# EAGLE schematic dangerous-DSO-v1a (EAGLE 5.07)
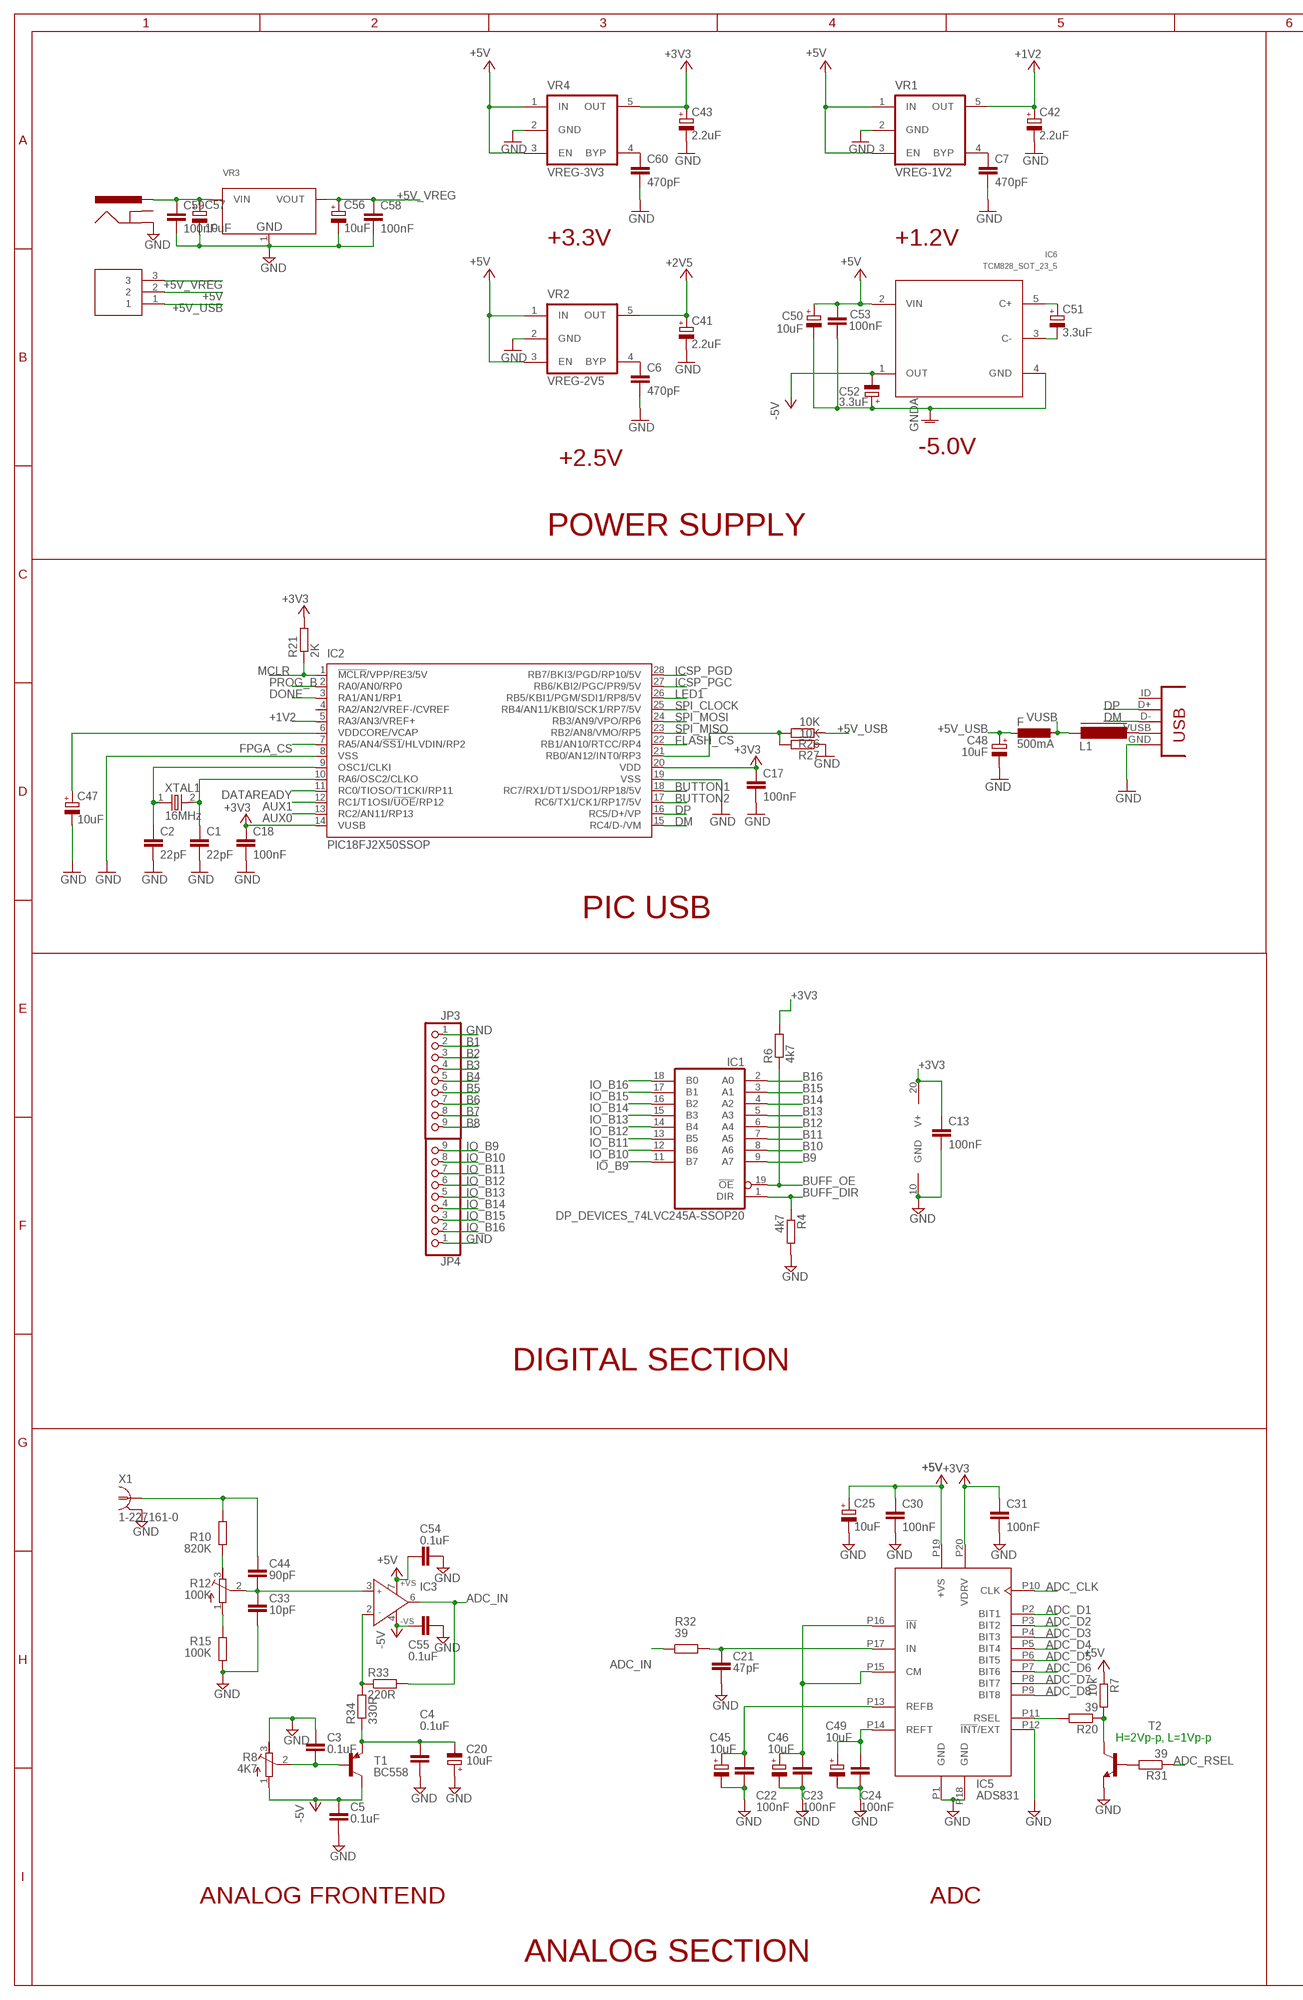
[diagram p0: schematic, sheet 1, part 1 of 2]
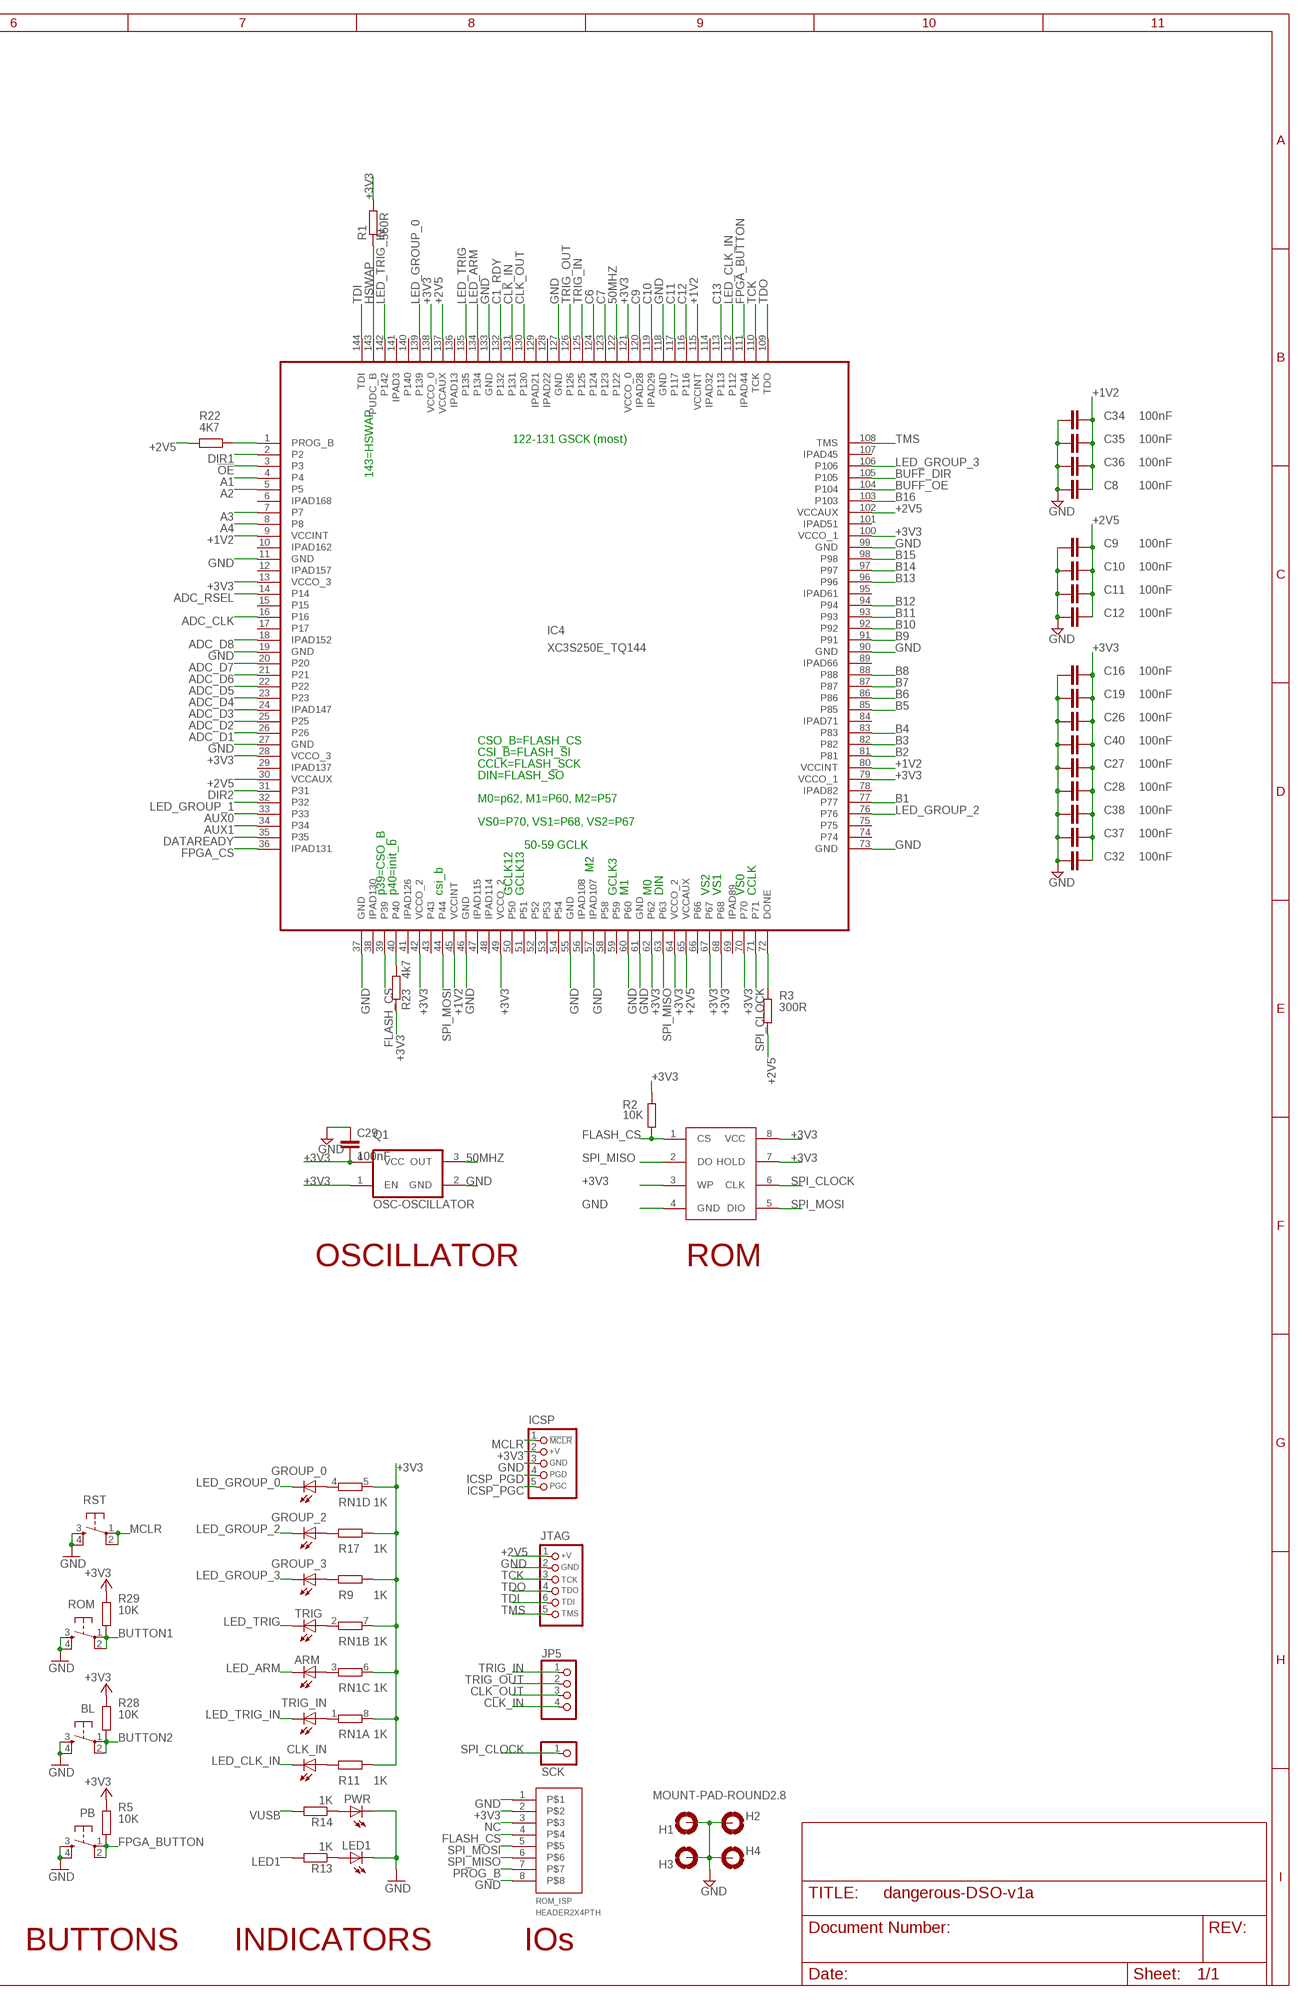
[diagram p1: schematic, sheet 1, part 2 of 2]

## Parts
5V_SEL  HEADER1X3PTH  [M1X3]
ARM  LED805  [LED-805]
BL  SMD_TACT_SMALL  [TACT_SWITCH_SMALL]
C1  22pF  CAPC603  [C603]
C2  22pF  CAPC603  [C603]
C3  0.1uF  CAPC603  [C603]
C4  0.1uF  CAPC603  [C603]
C5  0.1uF  CAPC603  [C603]
C6  470pF  CAPC603  [C603]
C7  470pF  CAPC603  [C603]
C8  100nF  CAPC603  [C603]
C9  100nF  CAPC603  [C603]
C10  100nF  CAPC603  [C603]
C11  100nF  CAPC603  [C603]
C12  100nF  CAPC603  [C603]
C13  100nF  CAPC603  [C603]
C16  100nF  CAPC603  [C603]
C17  100nF  CAPC603  [C603]
C18  100nF  CAPC603  [C603]
C19  100nF  CAPC603  [C603]
C20  10uF  CAP_POLSMC_A  [SMC_A]
C21  47pF  CAPC603  [C603]
C22  100nF  CAPC603  [C603]
C23  100nF  CAPC603  [C603]
C24  100nF  CAPC603  [C603]
C25  10uF  CAP_POLSMC_A  [SMC_A]
C26  100nF  CAPC603  [C603]
C27  100nF  CAPC603  [C603]
C28  100nF  CAPC603  [C603]
C29  100nF  CAPC603  [C603]
C30  100nF  CAPC603  [C603]
C31  100nF  CAPC603  [C603]
C32  100nF  CAPC603  [C603]
C33  10pF  CAPC603  [C603]
C34  100nF  CAPC603  [C603]
C35  100nF  CAPC603  [C603]
C36  100nF  CAPC603  [C603]
C37  100nF  CAPC603  [C603]
C38  100nF  CAPC603  [C603]
C40  100nF  CAPC603  [C603]
C41  2.2uF  CAP_POLSMC_A  [SMC_A]
C42  2.2uF  CAP_POLSMC_A  [SMC_A]
C43  2.2uF  CAP_POLSMC_A  [SMC_A]
C44  90pF  CAPC603  [C603]
C45  10uF  CAP_POLSMC_A  [SMC_A]
C46  10uF  CAP_POLSMC_A  [SMC_A]
C47  10uF  CAP_POLSMC_A  [SMC_A]
C48  10uF  CAP_POLSMC_A  [SMC_A]
C49  10uF  CAP_POLSMC_A  [SMC_A]
C50  10uF  CAP_POLSMC_A  [SMC_A]
C51  3.3uF  CAP_POLSMC_A  [SMC_A]
C52  3.3uF  CAP_POLSMC_A  [SMC_A]
C53  100nF  CAPC603  [C603]
C54  0.1uF  CAPC603  [C603]
C55  0.1uF  CAPC603  [C603]
C56  10uF  CAP_POLSMC_A  [SMC_A]
C57  10uF  CAP_POLSMC_A  [SMC_A]
C58  100nF  CAPC603  [C603]
C59  100nF  CAPC603  [C603]
C60  470pF  CAPC603  [C603]
CLK_IN  LED805  [LED-805]
F  500mA  L-EUL1812  [L1812]
GROUP_0  LED805  [LED-805]
GROUP_2  LED805  [LED-805]
GROUP_3  LED805  [LED-805]
H1  MOUNT-PAD-ROUND2.8  [2,8-PAD]
H2  MOUNT-PAD-ROUND2.8  [2,8-PAD]
H3  MOUNT-PAD-ROUND2.8  [2,8-PAD]
H4  MOUNT-PAD-ROUND2.8  [2,8-PAD]
IC1  DP_DEVICES_74LVC245A-SSOP20  [DP_DEVICES_SSOP20]
IC2  PIC18FJ2X50SSOP  [SSOP28]
IC3  AD820R  [SO8]
IC4  XC3S250E_TQ144  [TQFP144]
IC5  ADS831  [SSOP20-DBQ]
IC6  TCM828_SOT_23_5  [SOT-23-5]
IC8  W25X10  [SOIC8W]
ICSP  HEADER_PRG_PIC_ICSP  [HEADER_PRG_1X05]
J1  POWER_JACKSMD  [POWER_JACK_SMD]
JP3  PINHD-1X9  [1X09]
JP4  PINHD-1X9  [1X09]
JP5  PINHD-1X4  [1X04]
JTAG  HEADER_PRG_XILINX_JTAG6  [HEADER_PRG_1X06]
L1  FERRITE_BEAD603  [FB603]
LED1  LED805  [LED-805]
PB  SMD_TACT_SMALL  [TACT_SWITCH_SMALL]
PWR  LED805  [LED-805]
Q1  OSC-OSCILLATOR  [OSCILLATOR_7X5_SMD]
R1  560R  RESISTORR603  [R603]
R2  10K  RESISTORR603  [R603]
R3  300R  RESISTORR603  [R603]
R4  4k7  RESISTORR603  [R603]
R5  10K  RESISTORR603  [R603]
R6  4k7  RESISTORR603  [R603]
R7  10k  RESISTORR603  [R603]
R8  4K7  R-TRIMM4G/J  [RTRIM4G/J]
R9  1K  RESISTORR603  [R603]
R10  820K  RESISTORR603  [R603]
R11  1K  RESISTORR603  [R603]
R12  100K  R-TRIMM4G/J  [RTRIM4G/J]
R13  1K  RESISTORR603  [R603]
R14  1K  RESISTORR603  [R603]
R15  100K  RESISTORR603  [R603]
R17  1K  RESISTORR603  [R603]
R20  39  RESISTORR603  [R603]
R21  2K  RESISTORR603  [R603]
R22  4K7  RESISTORR603  [R603]
R23  4k7  RESISTORR603  [R603]
R26  10K  RESISTORR603  [R603]
R27  10K  RESISTORR603  [R603]
R28  10K  RESISTORR603  [R603]
R29  10K  RESISTORR603  [R603]
R31  39  RESISTORR603  [R603]
R32  39  RESISTORR603  [R603]
R33  220R  RESISTORR603  [R603]
R34  330R  RESISTORR603  [R603]
RN1  1K  RNETWORK  [RN8P-4R-CRA06S]
ROM  SMD_TACT_SMALL  [TACT_SWITCH_SMALL]
ROM_ISP  HEADER2X4PTH  [M2X4]
RST  SMD_TACT_SMALL  [TACT_SWITCH_SMALL]
SCK  PINHD-1X1  [1X01]
T1  BC558  BJT-PNPSOT23BEC  [SOT23-BEC]
T2  BJT-NPNSOT23BEC  [SOT23-BEC]
TRIG  LED805  [LED-805]
TRIG_IN  LED805  [LED-805]
USB  CONN_USB  [CONN_USB_MINI-B]
VR1  VREG-1V2  MIC5205  [SOT-23-5]
VR2  VREG-2V5  MIC5205  [SOT-23-5]
VR3  LD1117-3.3SOT223  [SOT223]
VR4  VREG-3V3  MIC5205  [SOT-23-5]
X1  1-227161-0  [AMP_227161]
XTAL1  16MHz  CRYSTAL  [HC-49U]

## Nets
50MHZ: IC4.122 Q1.3(OUT)
!OE: IC4.3
+1V2: C8.1 C34.1 C35.1 C36.1 C42.+ IC2.5(RA3/AN3/VREF+) IC4.9(VCCINT) IC4.45(VCCINT) IC4.80(VCCINT) IC4.115(VCCINT) VR1.5(OUT)
+2V5: C9.1 C10.1 C11.1 C12.1 C41.+ IC4.30(VCCAUX) IC4.65(VCCAUX) IC4.102(VCCAUX) IC4.137(VCCAUX) JTAG.1(+V) R3.1 R22.2 VR2.5(OUT)
+3V3: C13.1 C16.1 C17.1 C18.1 C19.1 C26.1 C27.1 C28.1 C29.2 C31.1 C32.1 C37.1 C38.1 C40.1 C43.+ IC1.20(V+) IC2.14(VUSB) IC2.20(VDD) IC4.13(VCCO_3) IC4.28(VCCO_3) IC4.42(VCCO_2) IC4.49(VCCO_2) IC4.62 IC4.64(VCCO_2) IC4.67 IC4.68 IC4.70 IC4.79(VCCO_1) IC4.100(VCCO_1) IC4.121(VCCO_0) IC4.138(VCCO_0) IC5.P20(VDRV) IC8.3(WP) IC8.7(HOLD) IC8.8(VCC) ICSP.2(+V) Q1.1(EN) Q1.4(VCC) R1.2 R2.2 R5.2 R6.2 R9.2 R11.2 R17.2 R21.2 R23.1 R28.2 R29.2 RN1.5 RN1.6 RN1.7 RN1.8 ROM_ISP.2 VR4.5(OUT)
+5V: 5V_SEL.2 C25.+ C30.1 C50.+ C53.1 C54.1 IC3.7(+VS) IC5.P19(+VS) IC6.2(VIN) R7.1 VR1.1(IN) VR1.3(EN) VR2.1(IN) VR2.3(EN) VR4.1(IN) VR4.3(EN)
+5V_USB: 5V_SEL.1 C48.+ F.2 R26.1
+5V_VREG: 5V_SEL.3 C56.+ C58.1 VR3.2(VOUT)
-5V: C5.1 C52.- C55.1 IC3.4(-VS) IC6.1(OUT) R8.1(E) T1.C
A1: IC4.4
A2: IC4.5
A3: IC4.7
A4: IC4.8
ADC_CLK: IC4.16 IC5.P10(CLK)
ADC_D1: IC4.26 IC5.P2(BIT1)
ADC_D2: IC4.25 IC5.P3(BIT2)
ADC_D3: IC4.24(IPAD147) IC5.P4(BIT3)
ADC_D4: IC4.23 IC5.P5(BIT4)
ADC_D5: IC4.22 IC5.P6(BIT5)
ADC_D6: IC4.21 IC5.P7(BIT6)
ADC_D7: IC4.20 IC5.P8(BIT7)
ADC_D8: IC4.18(IPAD152) IC5.P9(BIT8)
ADC_IN: IC3.6(OUT) R32.1 R33.2
ADC_RSEL: IC4.14 R31.1
AUX0: IC2.13(RC2/AN11/RP13) IC4.33
AUX1: IC2.12(RC1/T1OSI/!UOE!/RP12) IC4.34
B1: IC4.77 JP3.2
B2: IC4.81 JP3.3
B3: IC4.82 JP3.4
B4: IC4.83 JP3.5
B5: IC4.85 JP3.6
B6: IC4.86 JP3.7
B7: IC4.87 JP3.8
B8: IC4.88 JP3.9
B9: IC1.9(A7) IC4.91
B10: IC1.8(A6) IC4.92
B11: IC1.7(A5) IC4.93
B12: IC1.6(A4) IC4.94
B13: IC1.5(A3) IC4.96
B14: IC1.4(A2) IC4.97
B15: IC1.3(A1) IC4.98
B16: IC1.2(A0) IC4.103
BUFF_DIR: IC1.1(DIR) IC4.105 R4.1
BUFF_OE: IC1.19(!OE) IC4.104 R6.1
BUTTON1: IC2.18(RC7/RX1/DT1/SDO1/RP18/5V) R29.1 ROM.1 ROM.2
BUTTON2: BL.1 BL.2 IC2.17(RC6/TX1/CK1/RP17/5V) R28.1
C1_RDY: IC4.132
C6: IC4.124
C7: IC4.123
C9: IC4.120(IPAD28)
C10: IC4.119(IPAD29)
C11: IC4.117
C12: IC4.116
C13: IC4.113
CLK_IN: IC4.131 JP5.4
CLK_OUT: IC4.130 JP5.3
DATAREADY: IC2.11(RC0/TIOSO/T1CKI/RP11) IC4.35
DIR1: IC4.2
DIR2: IC4.31
DM: IC2.15(RC4/D-/VM) USB.D-
DONE: IC2.3(RA1/AN1/RP1) IC4.72(DONE) R3.2
DP: IC2.16(RC5/D+/VP) USB.D+
FLASH_CS: IC2.22(RB1/AN10/RTCC/RP4) IC4.39 IC8.1(CS) R2.1 ROM_ISP.4
FPGA_BUTTON: IC4.111(IPAD44) PB.1 PB.2 R5.1
FPGA_CS: IC2.7(RA5/AN4/!SS1!/HLVDIN/RP2) IC4.36(IPAD131)
GND: BL.3 BL.4 C1.2 C2.2 C3.1 C4.2 C5.2 C6.2 C7.2 C8.2 C9.2 C10.2 C11.2 C12.2 C13.2 C16.2 C17.2 C18.2 C19.2 C20.+ C21.2 C22.2 C23.2 C24.2 C25.- C26.2 C27.2 C28.2 C29.1 C30.2 C31.2 C32.2 C33.1 C34.2 C35.2 C36.2 C37.2 C38.2 C40.2 C41.- C42.- C43.- C45.- C46.- C47.- C48.- C49.- C50.- C52.+ C53.2 C54.2 C55.2 C56.- C57.- C58.2 C59.2 C60.2 H1.B2,8(MOUNT) H2.B2,8(MOUNT) H3.B2,8(MOUNT) H4.B2,8(MOUNT) IC1.10(GND) IC2.8(VSS) IC2.19(VSS) IC4.11(GND) IC4.19(GND) IC4.27(GND) IC4.37(GND) IC4.46(GND) IC4.55(GND) IC4.57(IPAD107) IC4.60 IC4.61(GND) IC4.73(GND) IC4.90(GND) IC4.99(GND) IC4.118(GND) IC4.127(GND) IC4.133(GND) IC5.P1(GND) IC5.P12(!INT!/EXT) IC5.P18(GND) IC6.4(GND) IC8.4(GND) ICSP.3(GND) J1.P$4(GND) JP3.1 JP4.1 JTAG.2(GND) LED1.C PB.3 PB.4 PWR.C Q1.2(GND) R4.2 R8.3(A) R15.2 R27.1 ROM.3 ROM.4 ROM_ISP.1 ROM_ISP.8 RST.3 RST.4 T2.E USB.GND VR1.2(GND) VR2.2(GND) VR3.1(GND) VR4.2(GND) X1.2(GND) ; supply symbol labelled GNDA
HSWAP: IC4.143(PUDC_B) R1.1
ICSP_PGC: IC2.27(RB6/KBI2/PGC/PR9/5V) ICSP.5(PGC)
ICSP_PGD: IC2.28(RB7/BKI3/PGD/RP10/5V) ICSP.4(PGD)
IO_B9: IC1.11(B7) JP4.9
IO_B10: IC1.12(B6) JP4.8
IO_B11: IC1.13(B5) JP4.7
IO_B12: IC1.14(B4) JP4.6
IO_B13: IC1.15(B3) JP4.5
IO_B14: IC1.16(B2) JP4.4
IO_B15: IC1.17(B1) JP4.3
IO_B16: IC1.18(B0) JP4.2
LED1: IC2.26(RB5/KBI1/PGM/SDI1/RP8/5V) R13.2
LED_ARM: ARM.C IC4.134
LED_CLK_IN: CLK_IN.C IC4.112
LED_GROUP_0: GROUP_0.C IC4.139
LED_GROUP_1: IC4.32
LED_GROUP_2: GROUP_2.C IC4.76
LED_GROUP_3: GROUP_3.C IC4.106
LED_TRIG: IC4.135 TRIG.C
LED_TRIG_IN: IC4.142 TRIG_IN.C
MCLR: IC2.1(!MCLR!/VPP/RE3/5V) ICSP.1(/MCLR) R21.1 RST.1 RST.2
N$1: CLK_IN.A R11.1
N$2: PWR.A R14.1
N$3: LED1.A R13.1
N$4: RN1.2 TRIG.A
N$5: L1.2 USB.VUSB
N$7: GROUP_0.A RN1.4
N$8: RN1.1 TRIG_IN.A
N$9: GROUP_2.A R17.1
N$10: GROUP_3.A R9.1
N$12: IC3.2(IN-) R33.1 R34.2
N$14: ARM.A RN1.3
N$16: C33.2 C44.1 IC3.3(IN+) R12.2(S)
N$17: C4.1 C20.- R34.1 T1.E
N$18: C3.2 R8.2(S) T1.B
N$19: IC5.P11(RSEL) R20.2
N$20: R7.2 R20.1 T2.C
N$21: C22.1 C45.+ IC5.P13(REFB)
N$22: C23.1 C46.+ IC5.P15(CM) IC5.P16(!IN)
N$23: C24.1 C49.+ IC5.P14(REFT)
N$24: R31.2 T2.B
N$25: IC4.40 R23.2
N$26: R12.1(E) R15.1
N$27: C60.1 VR4.4(BYP)
N$28: R10.2 R12.3(A)
N$29: C51.+ IC6.5(C+)
N$30: C44.2 R10.1 X1.1
N$32: C51.- IC6.3(C-)
N$93: C47.+ IC2.6(VDDCORE/VCAP)
N$99: C2.1 IC2.9(OSC1/CLKI) XTAL1.1
N$100: C1.1 IC2.10(RA6/OSC2/CLKO) XTAL1.2
N$112: IC2.21(RB0/AN12/INT0/RP3) R26.2 R27.2
N$114: C6.1 VR2.4(BYP)
N$118: C7.1 VR1.4(BYP)
NC: ROM_ISP.3
OPAMPOUT: C21.1 IC5.P17(IN) R32.2
PROG_B: IC2.2(RA0/AN0/RP0) IC4.1(PROG_B) R22.1 ROM_ISP.7
SPI_CLOCK: IC2.25(RB4/AN11/KBI0/SCK1/RP7/5V) IC4.71 IC8.6(CLK) SCK.1
SPI_MISO: IC2.23(RB2/AN8/VMO/RP5) IC4.63 IC8.2(DO) ROM_ISP.6
SPI_MOSI: IC2.24(RB3/AN9/VPO/RP6) IC4.44 IC8.5(DIO) ROM_ISP.5
TCK: IC4.110(TCK) JTAG.3(TCK)
TDI: IC4.144(TDI) JTAG.6(TDI)
TDO: IC4.109(TDO) JTAG.4(TDO)
TMS: IC4.108(TMS) JTAG.5(TMS)
TRIG_IN: IC4.125 JP5.1
TRIG_OUT: IC4.126 JP5.2
V+_EX: C57.+ C59.1 J1.VIN0(PWR) VR3.3(VIN)
VUSB: F.1 L1.1 R14.2
Unconnected: IC2.4(RA2/AN2/VREF-/CVREF) IC4.6(IPAD168) IC4.10(IPAD162) IC4.12(IPAD157) IC4.15 IC4.17 IC4.29(IPAD137) IC4.38(IPAD130) IC4.41(IPAD126) IC4.43 IC4.47(IPAD115) IC4.48(IPAD114) IC4.50 IC4.51 IC4.52 IC4.53 IC4.54 IC4.56(IPAD108) IC4.58 IC4.59 IC4.66 IC4.69(IPAD89) IC4.74 IC4.75 IC4.78(IPAD82) IC4.84(IPAD71) IC4.89(IPAD66) IC4.95(IPAD61) IC4.101(IPAD51) IC4.107(IPAD45) IC4.114(IPAD32) IC4.128(IPAD22) IC4.129(IPAD21) IC4.136(IPAD13) IC4.140 IC4.141(IPAD3) J1.GND USB.BODY@1(BODY) USB.BODY@2(BODY) USB.BODY@3(BODY) USB.BODY@4(BODY) USB.ID(USBID)

## Notes on the sheet
- +3.3V | +1.2V
- 122-131 GSCK (most)
- -5.0V
- +2.5V
- 143=HSWAP
- POWER SUPPLY
- CSO_B=FLASH_CS
- CSI_B=FLASH_SI
- CCLK=FLASH_SCK
- DIN=FLASH_SO
- M0=p62, M1=P60, M2=P57
- VS0=P70, VS1=P68, VS2=P67
- 50-59 GCLK
- M2
- p39=CSO_B | p40=init_b | csi_b | GCLK12 | GCLK13 | GCLK3 | M1 | M0 | DIN | VS2 | VS1 | VS0 | CCLK
- PIC USB
- OSCILLATOR | ROM
- DIGITAL SECTION
- H=2Vp-p, L=1Vp-p
- ANALOG FRONTEND | ADC
- BUTTONS | INDICATORS | IOs
- ANALOG SECTION

## Library data of the parts
5V_SEL = dp_devices:HEADER1X3
ARM CLK_IN GROUP_0 GROUP_2 GROUP_3 LED1 PWR TRIG TRIG_IN = dp_devices:LED
BL PB ROM RST = dp_devices:SMD_TACT_SMALL
C1-C13 C16-C19 C21-C24 C26-C38 C40 C44 C53-C55 C58-C60 = dp_devices:CAP
C20 C25 C41-C43 C45-C52 C56 C57 = dp_devices:CAP_POL
F = rcl:L-EU: INDUCTOR, European symbol
H1-H4 = holes:MOUNT-PAD-ROUND: MOUNTING PAD, round
IC1 = dangerous-DSO-v1:DP_DEVICES_74LVC245A: Octal Bus transceiver with 3-state, 3.3V supply
IC2 = dp_devices:PIC18FJ2X50; PIC18FJ2X50: PIC18FJ2X50
IC3 = analog-devices:AD820: Single-Supply, Rail-to-Rail, Low Power, FET Input Op Amp Source: http://www.analog.com/static/imported-files/data_sheets/AD820.pdf
IC4 = dp_devices:XC3S250E_TQ144: xc3s250e_tq144 edit this description Auto generated by make-symbol-device-package-bsdl.ulp Rev. 29 Source: xc3s250e_tq144.bsd
IC5 = dp_devices:ADS831: 8-bit 80MHz ADC
IC6 = dp_devices:TCM828_SOT_23_5
IC8 = dp_devices:W25X10
ICSP = dp_devices:HEADER_PRG_PIC_ICSP: 5-pin PIC In Circuit Serial Programming header
J1 = SparkFun-3-2-07:POWER_JACK: Power Jack This is the standard 5.5mm barrel jack for power. The PTH is the most common, proven, reliable, footprint. All others are experimental. The Slot footprint only works if the mill layer is transmitted to the PCB fab house so be warned. Spark Fun Electronics SKU : PType-BPJ. Mating wall wart : Tools-PS
JP3 JP4 = pinhead-2:PINHD-1X9: PIN HEADER
JP5 = pinhead-2:PINHD-1X4: PIN HEADER
JTAG = dp_devices:HEADER_PRG_XILINX_JTAG6: 6-pin Xilinx JTAG programming header
L1 = dp_devices:FERRITE_BEAD
Q1 = dp_devices:OSC-OSCILLATOR: Oscillator
R1-R7 R9-R11 R13-R15 R17 R20-R23 R26-R29 R31-R34 = dp_devices:RESISTOR
R8 R12 = resistor:R-TRIMM: Trimm resistor
RN1 = dp_devices:RNETWORK: 4 Resistor Array 0603
ROM_ISP = dp_devices:HEADER2X4
SCK = pinhead:PINHD-1X1: PIN HEADER
T1 = dp_devices:BJT-PNP: Most commonly used is SOT23-BEC
T2 = dp_devices:BJT-NPN: Most commonly used is SOT23-BEC
USB = dp_devices:CONN_USB: USB connector
VR1 VR2 VR4 = dp_devices:MIC5205: 150ma Low-Noise LDO Regulator
VR3 = dp_devices:LD1117-3.3
X1 = con-coax:?227161*: JACK, RIGHT ANGLE, 50 OHM, PCB, BNC Source: amp_227161.pdf
XTAL1 = dp_devices:CRYSTAL